# EAGLE design NodeServo.cg2 (EAGLE 4.16)
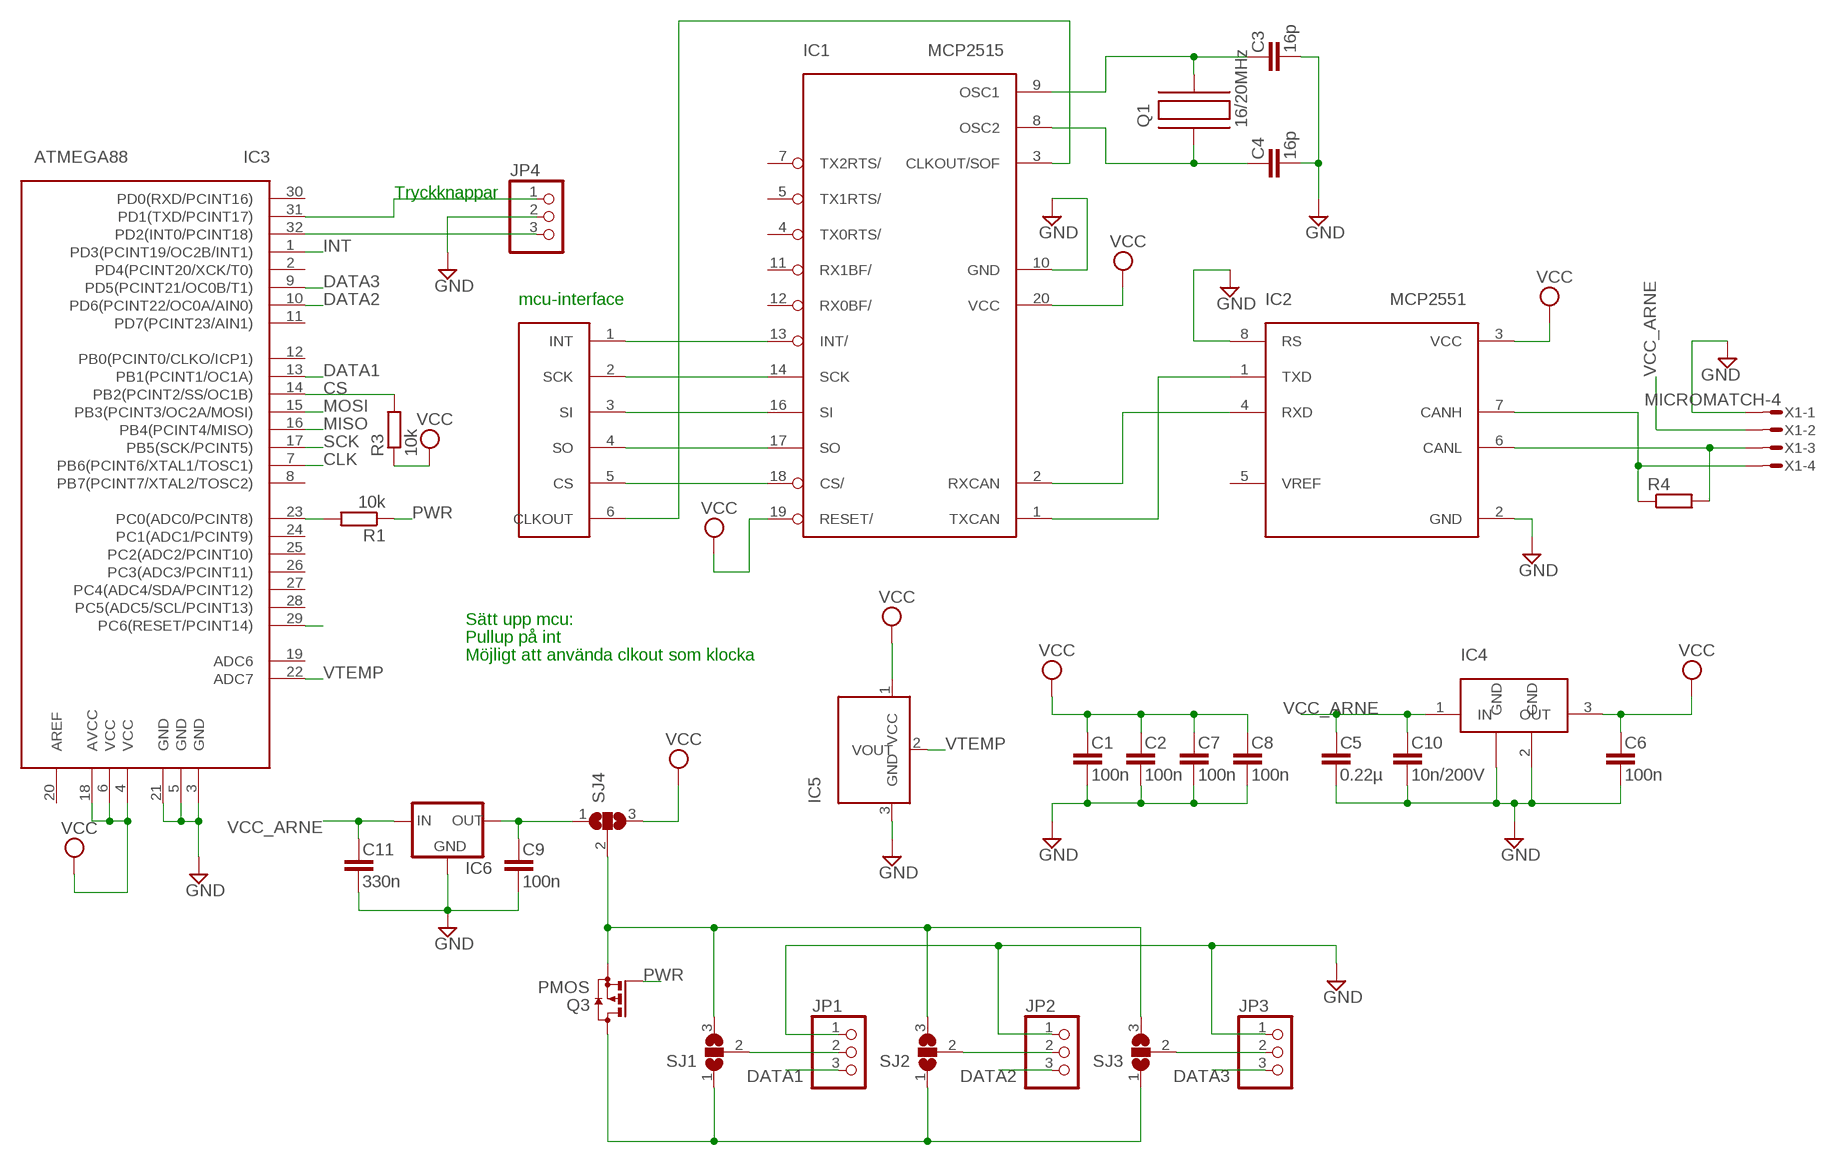
[diagram p0: schematic, sheet 1]

## Parts
C1  100n  C-EU  [C0603]
C2  100n  C-EU  [C0603]
C3  16p  C-EU  [C0603]
C4  16p  C-EU  [C0603]
C5  0.22µ  C-EU  [C0603]
C6  100n  C-EU  [C0603]
C7  100n  C-EU  [C0603]
C8  100n  C-EU  [C0603]
C9  100n  C-EU  [C0603]
C10  10n/200V  C-EU  [C0603]
C11  330n  C-EU  [C0603]
IC1  MCP2515  [TSSOP]
IC2  MCP2551  [SOIC]
IC3  ATMEGA88  [TQFP32]
IC4  LM340MP-5.0  [SOT223]
IC5  TC1047A  [SOT23]
IC6  78XXS"  [78XXS]
JP1  PINHD-1X3  [1X03]
JP2  PINHD-1X3  [1X03]
JP3  PINHD-1X3  [1X03]
JP4  PINHD-1X3  [1X03]
Q1  16/20MHz  C-MAC-LFA147E  [SMD]
Q3  PMOS  [SOT23]
R1  10k  R-EUR0603  [R0603]
R3  10k  R-EUR0603  [R0603]
R4  R-EUR0603  [R0603]
SJ1  SJ_2_NOS  [SJ_2_NO_SMALL]
SJ2  SJ_2_NOS  [SJ_2_NO_SMALL]
SJ3  SJ_2_NOS  [SJ_2_NO_SMALL]
SJ4  SJ_2_NOS  [SJ_2_NO_SMALL]
U$1  CAN-INTERFACE  [VIA-LIST]
X1  MICROMATCH-4  [MICROMATCH-4]

## Nets
CANH: IC2.7(CANH) R4.1 X1.4
CANL: IC2.6(CANL) R4.2 X1.3
CLK: IC1.3(CLKOUT/SOF) IC3.7(PB6(PCINT6/XTAL1/TOSC1)) U$1.6(CLKOUT)
CS: IC1.18(CS/) IC3.14(PB2(PCINT2/SS/OC1B)) R3.2 U$1.5(CS)
DATA1: IC3.13(PB1(PCINT1/OC1A)) JP1.3
DATA2: IC3.10(PD6(PCINT22/OC0A/AIN0)) JP2.3
DATA3: IC3.9(PD5(PCINT21/OC0B/T1)) JP3.3
GND: C1.2 C2.2 C3.2 C4.2 C5.2 C6.2 C7.2 C8.2 C9.2 C10.2 C11.2 IC1.10(GND) IC2.2(GND) IC2.8(RS) IC3.3(GND) IC3.5(GND) IC3.21(GND) IC4.2(GND) IC4.4(GND) IC5.3(GND) IC6.GND JP1.1 JP2.1 JP3.1 JP4.2 X1.1
INT: IC1.13(INT/) IC3.1(PD3(PCINT19/OC2B/INT1)) U$1.1(INT)
MISO: IC1.17(SO) IC3.16(PB4(PCINT4/MISO)) U$1.4(SO)
MOSI: IC1.16(SI) IC3.15(PB3(PCINT3/OC2A/MOSI)) U$1.3(SI)
N$1: IC1.2(RXCAN) IC2.4(RXD)
N$2: IC1.1(TXCAN) IC2.1(TXD)
N$3: IC3.32(PD2(INT0/PCINT18)) JP4.3
N$4: JP1.2 SJ1.2
N$5: IC3.31(PD1(TXD/PCINT17)) JP4.1
N$6: IC3.23(PC0(ADC0/PCINT8)) R1.2
N$8: JP2.2 SJ2.2
N$9: JP3.2 SJ3.2
N$10: Q3.3(D) SJ1.1 SJ2.1 SJ3.1
N$11: C9.1 IC6.OUT SJ4.1
N$12: C3.1 IC1.9(OSC1) Q1.P$2
N$13: C4.1 IC1.8(OSC2) Q1.P$1
N$14: Q3.2(S) SJ1.3 SJ2.3 SJ3.3 SJ4.2
PWR: Q3.1(G) R1.1
RESET: IC3.29(PC6(RESET/PCINT14))
SCK: IC1.14(SCK) IC3.17(PB5(SCK/PCINT5)) U$1.2(SCK)
VCC: C1.1 C2.1 C6.1 C7.1 C8.1 IC1.19(RESET/) IC1.20(VCC) IC2.3(VCC) IC3.4(VCC) IC3.6(VCC) IC3.18(AVCC) IC4.3(OUT) IC5.1(VCC) R3.1 SJ4.3
VCC_ARNE: C5.1 C10.1 C11.1 IC4.1(IN) IC6.IN X1.2
VTEMP: IC3.22(ADC7) IC5.2(VOUT)
Unconnected: IC1.4(TX0RTS/) IC1.5(TX1RTS/) IC1.7(TX2RTS/) IC1.11(RX1BF/) IC1.12(RX0BF/) IC2.5(VREF) IC3.2(PD4(PCINT20/XCK/T0)) IC3.8(PB7(PCINT7/XTAL2/TOSC2)) IC3.11(PD7(PCINT23/AIN1)) IC3.12(PB0(PCINT0/CLKO/ICP1)) IC3.19(ADC6) IC3.20(AREF) IC3.24(PC1(ADC1/PCINT9)) IC3.25(PC2(ADC2/PCINT10)) IC3.26(PC3(ADC3/PCINT11)) IC3.27(PC4(ADC4/SDA/PCINT12)) IC3.28(PC5(ADC5/SCL/PCINT13)) IC3.30(PD0(RXD/PCINT16))

## Notes on the sheet
- Tryckknappar
- DATA3
- DATA2 | mcu-interface
- DATA1
- PWR
- Sätt upp mcu:
- Pullup på int
- Möjligt att använda clkout som klocka
- VTEMP
- VTEMP
- PWR
- DATA1 | DATA2 | DATA3

## Library data of the parts
C1-C11 = rcl:C-EU
IC1 = mcp2515:MCP2515
IC2 = mcp2551:MCP2551
IC3 = atmega88:ATMEGA88
IC4 = lm340mp:LM340MP-5.0
IC5 = tc1047a:TC1047A
IC6 = 78xx:78XXS: VOLTAGE REGULATOR
JP1-JP4 = pinhead-mm:PINHD-1X3
Q1 = hc49-4h-smx:C-MAC-LFA147E
Q3 = transistor:PMOS
R1 R3 R4 = rcl:R-EU
SJ1-SJ4 = jumper:SJ_2_NO
U$1 = can-interface:CAN-INTERFACE
X1 = con-amp-micromatch:MICROMATCH-4: MicroMaTch 4 7-215464-4 / 0-215464-4 Drawing Number C-215464 DDEController.pdf

## Board
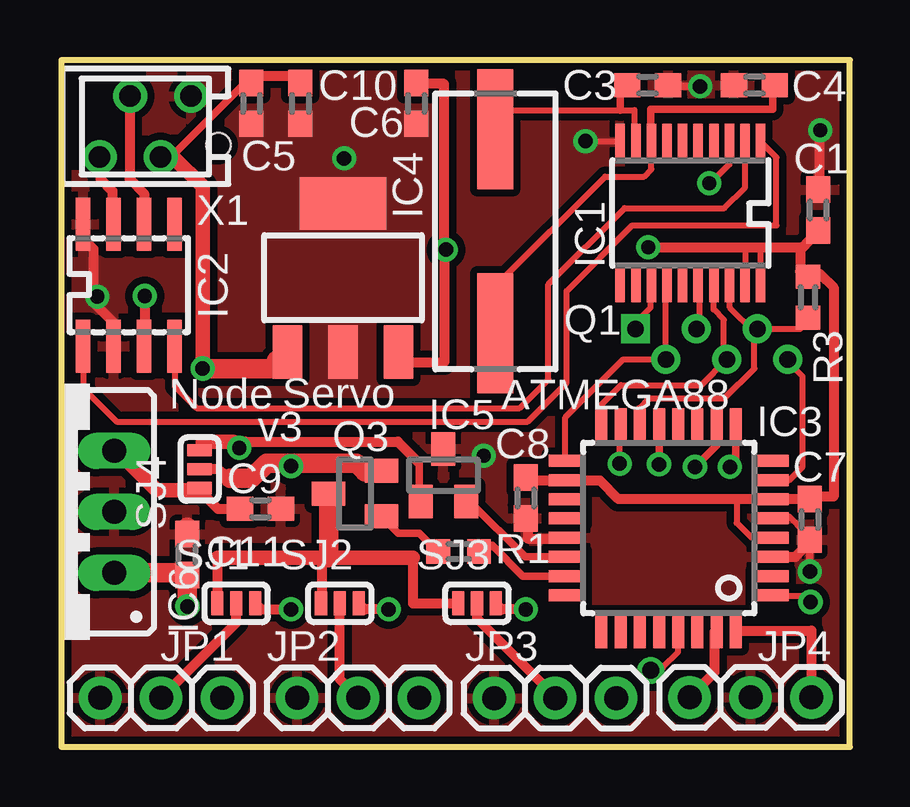
[diagram p1: board, top side]
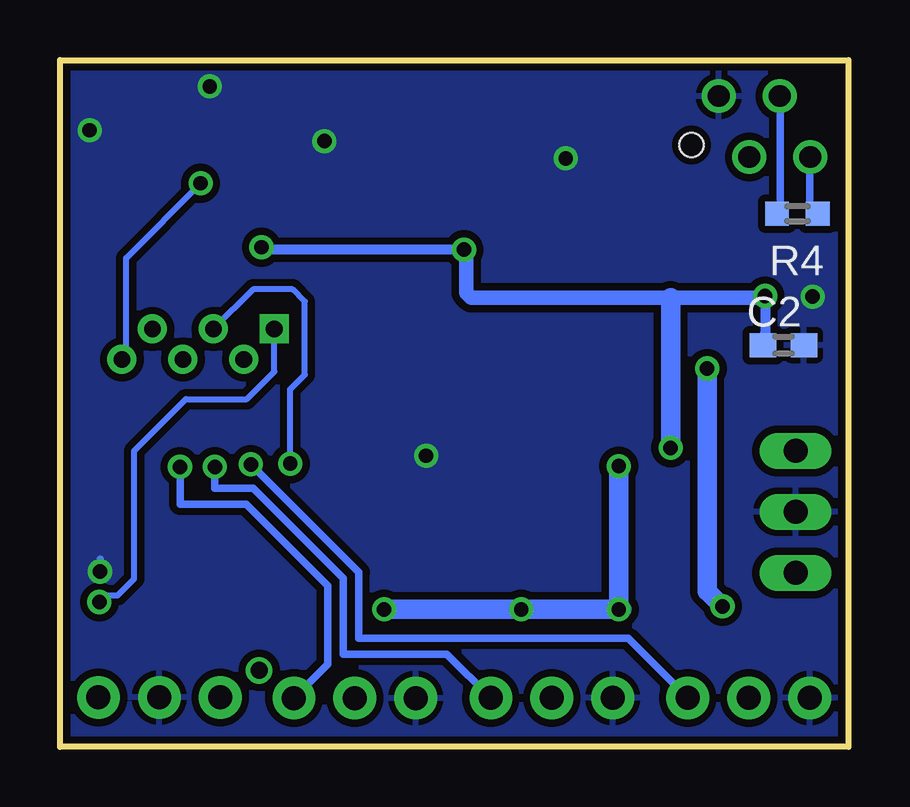
[diagram p2: board, bottom side, seen from below]

Size 32.85 x 28.62 mm. Coordinates in mm from the lower left corner, seen from the top.
Outline: 0,0 32.85,0 32.85,28.62 0,28.62 0,0
Copper layers (1*16): Top 0.035mm / dielectric 1.5mm / Bottom 0.035mm
Design rules "10mils, 0.6drill": minimum track width 10mil, minimum drill 0.6mm, track to track 10mil, track to pad 10mil, pad to pad 10mil, via to via 10mil, smd to smd 10mil, copper to edge 10mil, drill to drill 10mil, minimum pad ring 10mil, minimum via ring 8mil, stop-mask expansion 0mil, vias tented up to drill 0mil, thermal gap 10mil

### Footprints (pad centres in the part's own frame; a part is rotated, then mirrored left to right if it is on the bottom)
C0603 = smd 1.1 x 1: 1 -0.85,0; 2 0.85,0
TSSOP = smd 0.396 x 1.5: 1 -2.925,-2.975; 2 -2.275,-2.975; 3 -1.625,-2.975; 4 -0.975,-2.975; 5 -0.325,-2.975; 6 0.325,-2.975; 7 0.975,-2.975; 8 1.625,-2.975; 9 2.275,-2.975; 10 2.925,-2.975; 11 2.925,2.975; 12 2.275,2.975; 13 1.625,2.975; 14 0.975,2.975; 15 0.325,2.975; 16 -0.325,2.975; 17 -0.975,2.975; 18 -1.625,2.975; 19 -2.275,2.975; 20 -2.925,2.975
SOIC = smd 0.6 x 2.2: 1 -1.905,-2.54; 2 -0.635,-2.54; 3 0.635,-2.54; 4 1.905,-2.54; 5 1.905,2.54; 6 0.635,2.54; 7 -0.635,2.54; 8 -1.905,2.54
TQFP32 = smd 1.5 x 0.5: 1 -4.25,2.65; 2 -4.25,1.85; 3 -4.25,1.05; 4 -4.25,0.25; 5 -4.25,-0.55; 6 -4.25,-1.35; 7 -4.25,-2.15; 8 -4.25,-2.95; 17 4.25,-2.95; 18 4.25,-2.15; 19 4.25,-1.35; 20 4.25,-0.55; 21 4.25,0.25; 22 4.25,1.05; 23 4.25,1.85; 24 4.25,2.65 | smd 0.5 x 1.5: 9 -2.8,-4.4; 10 -2,-4.4; 11 -1.2,-4.4; 12 -0.4,-4.4; 13 0.4,-4.4; 14 1.2,-4.4; 15 2,-4.4; 16 2.8,-4.4; 25 2.8,4.1; 26 2,4.1; 27 1.2,4.1; 28 0.4,4.1; 29 -0.4,4.1; 30 -1.2,4.1; 31 -2,4.1; 32 -2.8,4.1
SOT223 = smd 1.219 x 2.235: 1 -2.311,-3.099; 2 0,-3.099; 3 2.311,-3.099 | smd 3.6 x 2.2: 4 0,3.099
SOT23 = smd 1 x 1.4: 1 -0.95,-1.1; 2 0.95,-1.1; 3 0,1.1
78XXS = drill 1 long: GND 0,-2.54; IN -2.54,-2.54; OUT 2.54,-2.54
1X03 = drill 1 pad 1.778 round: 1 -2.54,0; 2 0,0; 3 2.54,0
SMD = smd 5 x 1.5: P$1 4.25,0; P$2 -4.25,0
R0603 = smd 0.991 x 1.016: 1 -0.85,0; 2 0.85,0
SJ_2_NO_SMALL = smd 0.508 x 1.016: 1 -0.787,0; 2 0,0; 3 0.787,0
VIA-LIST = drill 0.7 square: 1 0,2.54 | drill 0.7 round: 2 -1.27,1.27; 3 0,0; 4 -1.27,-1.27; 5 0,-2.54; 6 -1.27,-3.81
MICROMATCH-4 = drill 0.9 round: 1 1.905,1.27; 2 0.635,-1.27; 3 -0.635,1.27; 4 -1.905,-1.27 | hole 1: 3.048,-0.762

### Placement (x,y rotation side)
C1  31.54,22.36 90 top
C2  2.7,16.74 0 bottom
C3  24.43,27.57 0 top
C4  28.87,27.57 180 top
C5  7.92,26.81 270 top
C6  14.77,26.81 270 top
C7  31.17,9.48 270 top
C8  19.34,10.37 270 top
C9  8.3,9.92 0 top
C10  9.95,26.81 270 top
C11  5.25,8.01 90 top
IC1  26.21,22.24 180 top
IC2  2.8,19.24 0 top
IC3  25.3,8.97 180 top
IC4  11.73,19.54 0 top
IC5  15.92,11.32 0 top
IC6  -0.34,9.79 90 top
JP1  4.15,2.04 0 top
JP2  12.36,2.04 0 top
JP3  20.57,2.03 0 top
JP4  28.71,2.06 0 top
Q1  18.08,21.48 270 top
Q3  12.23,10.55 90 top
R1  16.55,8.14 0 top
R3  31.11,18.73 270 top
R4  2.12,22.21 180 bottom
SJ1  7.28,5.98 0 top
SJ2  11.6,5.98 0 top
SJ3  17.31,5.98 0 top
SJ4  5.76,11.57 90 top
U$1  26.46,17.41 90 top
X1  3.5,25.84 0 top

### Tracks (layer width: path | path; a pad name or v marks a point on that pad's centre or on a via)
CANH
  Top 0.305: 2.12,21.82 IC2.7 | X1.4 1.62,24.57
  Top 0.406: 2.12,21.82 2.12,23.15 1.62,23.66 1.62,24.57
  Bottom 0.305: X1.4 1.62,24.57 1.62,22.55 R4.1
CANL
  Top 0.305: IC2.6 | X1.3 2.84,27.11
  Top 0.406: IC2.6 3.45,23.05 2.84,23.66 2.84,27.11
  Bottom 0.305: X1.3 2.84,27.11 2.84,22.35 R4.2
CLK  (via drill 0.6)
  Top 0.254: IC1.3 27.83,25.11 27.83,24.27 27.02,23.46 v26.99,23.48 | IC3.7 30.32,11.12 30.88,11.67 30.88,15.43 30.22,16.09 30.17,16.14
  Top 0.406: 30.17,16.04 30.22,16.09 U$1.6
  Bottom 0.254: v26.99,23.48 30.09,20.36 30.09,16.29 U$1.6
CS
  Top 0.254: IC1.18 27.83,19.39 27.86,19.39 27.86,18.3 28.87,17.28 | IC3.14 24.07,13.5 | 24.07,13.5 24.07,13.51 | 28.87,17.28 28.87,15.76 27.63,14.52 24.48,14.52 24.07,14.11 24.07,13.7 24.17,12.99 24.07,13.5 | 28.87,17.28 U$1.5 30.78,17.41 31.03,17.67 31.03,17.87 30.97,17.87 R3.2
DATA1  (via drill 0.6)
  Top 0.305: IC3.13 v24.9,11.77
  Bottom 0.305: JP1.3 9.18,4.52 20.4,4.52 20.4,7.27 v24.9,11.77
DATA2  (via drill 0.6)
  Top 0.305: v26.4,11.67 27.3,12.57 27.3,12.62 | 27.3,12.62 27.3,12.77 | IC3.10 27.3,12.62
  Bottom 0.305: JP2.3 16.73,3.87 21.05,3.87 21.05,7.02 24.8,10.77 26.4,10.77 v26.4,11.67
DATA3  (via drill 0.6)
  Top 0.305: IC3.9 28.05,13.31 28.1,13.27 28.1,12.62 | v27.85,11.67 28.1,11.92 28.1,12.62 | 28.1,12.62 28.1,12.82
  Bottom 0.305: JP3.3 21.7,3.44 21.7,6.72 25.1,10.12 27.85,10.12 v27.85,11.67
GND  (via drill 0.6)
  Top 0.254: v21.84,25.23 23.28,25.23 IC1.10 | C1.2 31.59,23.53 | 1.34,18.5 v1.49,18.76 | 20.56,8.67 IC3.21 21.28,8.7 | C7.2 31.11,8.95 30.93,8.95 30.32,9.59 29.76,9.54 29.74,9.52 IC3.5 | v31.61,25.69 31.44,25.64 31.59,25.49
  Top 0.305: IC2.2 2.2,17.03 | C3.2 25.45,27.52 v26.61,27.52 | 30.93,8.95 31.16,8.95 31.18,8.93 31.18,8.42 v31.18,7.3
  Top 0.406: 2.2,17.03 2.2,17.64 1.34,18.5 1.34,20.74 0.83,21.25 IC2.8 | 20.56,8.67 19.42,8.67 19.42,9.34 19.35,9.41 19.34,9.41 C8.2 | 31.59,23.53 31.59,25.49 | 31.18,8.42 31.08,8.42 30.58,7.92 IC3.3
  Top 0.813: C11.2 5.25,9.16
  Bottom 0.305: v26.61,27.52 26.56,27.6 | v31.18,7.3 31.18,7.81
  other vias: 11.78,24.52 17.59,12.13
  pour Bottom (isolate 0.305): 0.12,28.51 32.83,28.51 32.83,0.1 24.38,0.1 0.12,0.1
  pour Top (isolate 0.305, no thermals): 5.83,28.15 15.89,28.15 15.89,14.43 5.83,14.43
  pour Top (isolate 0.305): 0.17,28.46 32.68,28.46 32.68,0.08 0.17,0.08
INT  (via drill 0.6)
  Top 0.254: IC1.13 | IC1.13 | U$1.1 23.92,17.67 24.55,18.3 24.55,19.24 IC1.13 | IC3.1 29.48,6.32 29.46,6.29 30.01,6.34 30.07,6.29 30.95,6.29 v31.21,6.03
  Bottom 0.254: v31.21,6.03 30.9,6.31 30.45,6.31 29.76,7 29.76,12.33 27.6,14.49 25.06,14.49 23.92,15.63 U$1.1
MISO
  Top 0.254: IC1.17 27.18,19.33 27.17,19.32 27.17,18.22 27.6,17.79 27.6,16.4 27.73,16.27 U$1.4 26.66,15.07 23.31,15.07 22.45,14.21 22.45,12.89 22.44,12.88 22.41,12.88 | IC3.16 22.41,12.88 | 22.41,12.88 22.39,12.95
MOSI  (via drill 0.6)
  Top 0.254: IC1.16 26.53,19.39 26.51,19.37 26.51,19.14 26.58,19.06 26.58,17.54 U$1.3 | IC3.15 23.3,13.34 23.26,13.3 v23.26,11.8
  Bottom 0.254: U$1.3 26.51,17.46 | U$1.3 26.41,17.36 | v23.26,11.8 23.26,14.9 22.65,15.51 22.65,18.55 23.16,19.06 24.81,19.06 U$1.3
N$1
  Top 0.254: 4.77,16.65 4.75,16.65 IC2.4 4.71,16.68 4.74,16.65 4.74,15 5.63,14.11 19.09,14.11 20.29,15.3 20.29,19.27 23.46,22.44 27.63,22.44 28.48,23.3 IC1.2
N$2
  Top 0.254: IC1.1 29.79,24.56 29.79,21.73 23.79,21.73 21.05,18.99 21.05,15.18 19.42,13.55 2.3,13.55 0.91,14.95 IC2.1 | IC2.1 0.91,16.75 | IC2.1
N$3
  Top 0.305: IC3.32 28.1,4.82
  Top 0.406: IC3.32 28.1,4.84 31.25,4.84 JP4.3
N$4
  Top 0.406: 7.28,6.11 SJ1.2 7.28,5.16 JP1.2
N$5
  Top 0.305: IC3.31 27.25,4.81
  Top 0.406: IC3.31 27.22,4.78 27.22,3.11 JP4.1
N$6
  Top 0.305: R1.2 17.57,8.14 17.95,8.39 19.23,7.12 IC3.23
N$8
  Top 0.406: JP2.2 11.6,2.81 SJ2.2
N$9
  Top 0.406: 20.55,2.02 20.55,2.03 JP3.2 20.6,2.03 20.62,2.04 17.31,5.35 SJ3.2
  Top 0.61: JP3.2 20.49,2.03
N$10
  Top 0.406: SJ2.1 10.84,5.98 10.84,7.89 | 16.55,5.98 SJ3.1 14.65,5.98 14.65,7.89 | SJ1.1 6.52,5.98 6.52,7.89
  Top 0.61: 6.52,7.89 8.3,7.89 | 8.3,7.89 8.42,7.89 | 8.3,7.89 10.84,7.89 11.09,7.89 14.65,7.89
  Top 0.813: Q3.3 11.13,8.06 11.09,7.89
N$11
  Top 0.406: SJ4.1 5.76,10.68 6.52,9.92 C9.1
  Top 0.61: IC6.OUT 2.33,12.33 3.98,10.68 5.76,10.68
N$12
  Top 0.254: IC1.9 23.87,25.56 23.87,26.53 23.28,26.53 18.13,26.53 Q1.P$2
  Top 0.305: C3.1 23.28,27.1 23.28,26.53
N$13
  Top 0.254: Q1.P$1 18.14,19.26 22.65,23.76 24.27,23.76 24.58,24.07 24.58,24.98 24.55,25.01 24.55,25.09
  Top 0.305: IC1.8 24.55,25.09 24.55,26.56 29.63,26.56 29.63,27.61 C4.1
N$14  (via drill 0.6)
  Top 0.254: 12.64,11.47 Q3.2
  Top 0.406: SJ3.3 18.36,5.73 v19.35,5.73 | SJ2.3 12.64,5.73 v13.63,5.73 | 8.3,5.73 8.04,5.98 SJ1.3 8.3,5.75 8.3,5.73 | 7.03,11.19 6.52,11.57 SJ4.2 | 8.3,5.73 v9.57,5.73
  Top 0.813: 12.64,11.47 12.29,11.82 9.57,11.82 | 9.57,11.82 8.55,11.82 7.92,11.19 7.03,11.19 | v9.57,11.7 9.57,11.82
  Bottom 0.813: v19.35,5.73 v13.63,5.73 v9.57,5.73 | v9.57,5.73 9.44,5.73 | v9.57,5.73 v9.57,11.7
PWR
  Top 0.305: Q3.1 14.04,8.9 14.9,8.9 15.66,8.14 R1.1
RESET  (via drill 0.7)
  Top 0.254: 25.7,4.59 25.7,4.33 | v24.55,3.19 25.06,3.31 25.7,3.95 25.7,4.59 | 25.7,4.59 IC3.29
SCK
  Top 0.254: IC1.14 25.23,19.36 25.19,19.32 IC1.14 25.19,19.27 U$1.2 23.41,16.14 21,13.73 21,11.85 IC3.17
VCC  (via drill 0.6)
  Top 0.254: 29.81,10.32 IC3.6 29.05,10.32 | 21.28,11.09 IC3.18 | IC1.20 29.12,19.39 29.12,20.82 29.68,20.82 | IC1.19 28.48,19.33 28.49,19.32 28.49,20.82 28.49,20.84 | 30.57,20.87 30.78,20.87 30.9,20.84 | IC3.4 28.75,8.72 28.13,9.34 28.13,10.32
  Top 0.305: 19.35,11.32 C8.1 | SJ4.3 5.88,12.48 | 14.84,11.88 14.9,11.82 14.9,10.28 IC5.1
  Top 0.406: 15.95,20.71 15.95,16 14.08,16 14.08,16.7 IC4.3 | IC2.3 3.42,17.08 3.47,17.56 v3.47,18.78 | 15.95,20.71 15.95,27.62 14.83,27.62 14.77,27.57 C6.1 | v16.02,20.71 15.95,20.71 | v24.45,20.82 28.49,20.82 29.68,20.82 | 29.68,20.82 29.68,20.81 | IC3.18 20.56,11.09 19.8,11.09 C8.1 | 29.81,10.32 30.7,10.32 C7.1 31.41,10.43 32.17,10.43 32.17,19.14 31.61,19.7 30.88,19.7 | 21.28,11.09 22.45,11.09 23.21,10.32 28.13,10.32 29.05,10.32 | 29.68,20.82 30.78,20.82 | 30.78,20.82 30.9,20.82 30.9,20.84 C1.1 | 30.88,19.7 30.88,19.61 R3.1 | 30.88,19.7 30.78,19.8 30.78,20.82 | 14.9,10.17 14.94,10.22 IC5.1 | 14.84,11.88 14.01,12.71 7.66,12.71 v7.41,12.46 | SJ4.3 5.76,12.46
  Top 0.61: 5.88,12.48 5.88,12.71 7.15,12.71 v7.41,12.46
  Bottom 0.254: 3.47,17.23 C2.1
  Bottom 0.406: 3.47,17.23 3.47,18.71 v3.47,18.78 | v24.45,20.82 24.4,20.82 24.3,20.71 v16.02,20.71 | 11.15,18.71 11.15,18.72
  Bottom 0.61: 3.47,18.71 7.41,18.71 11.15,18.71 15.71,18.71 15.92,18.91 15.92,20.71 v16.02,20.71
  Bottom 0.813: v7.41,12.46 7.41,18.71
VCC_ARNE  (via drill 0.6)
  Top 0.254: 7.88,27.62 C5.1
  Top 0.305: IC4.1 9.31,16.44 8.97,16.1 8.61,15.74 | 7.88,27.62 7.61,27.62 4.56,24.57 4.26,24.57 | 4.26,24.57 X1.2 | 4.67,24.57 4.26,24.57
  Top 0.406: C10.1 9.95,27.95 7.92,27.95 C5.1
  Top 0.61: 4.67,24.57 5.88,23.36 v5.88,15.76 6.01,15.76
  Top 0.813: 8.97,16.1 9.31,15.76 6.01,15.76 | v5.25,5.85 C11.1 5.21,7.16 5.12,7.25 IC6.IN
  Bottom 0.813: v5.88,15.76 5.88,6.49 v5.25,5.85
VTEMP
  Top 0.254: IC5.2 16.87,10.11
  Top 0.305: IC5.2 17.02,10.22 19.32,7.92 20.62,7.92
  Top 0.406: 20.62,7.92 IC3.22

### Text on the board
tPlace: Node | Servo | v3